# EAGLE schematic board (EAGLE 7.5.0)
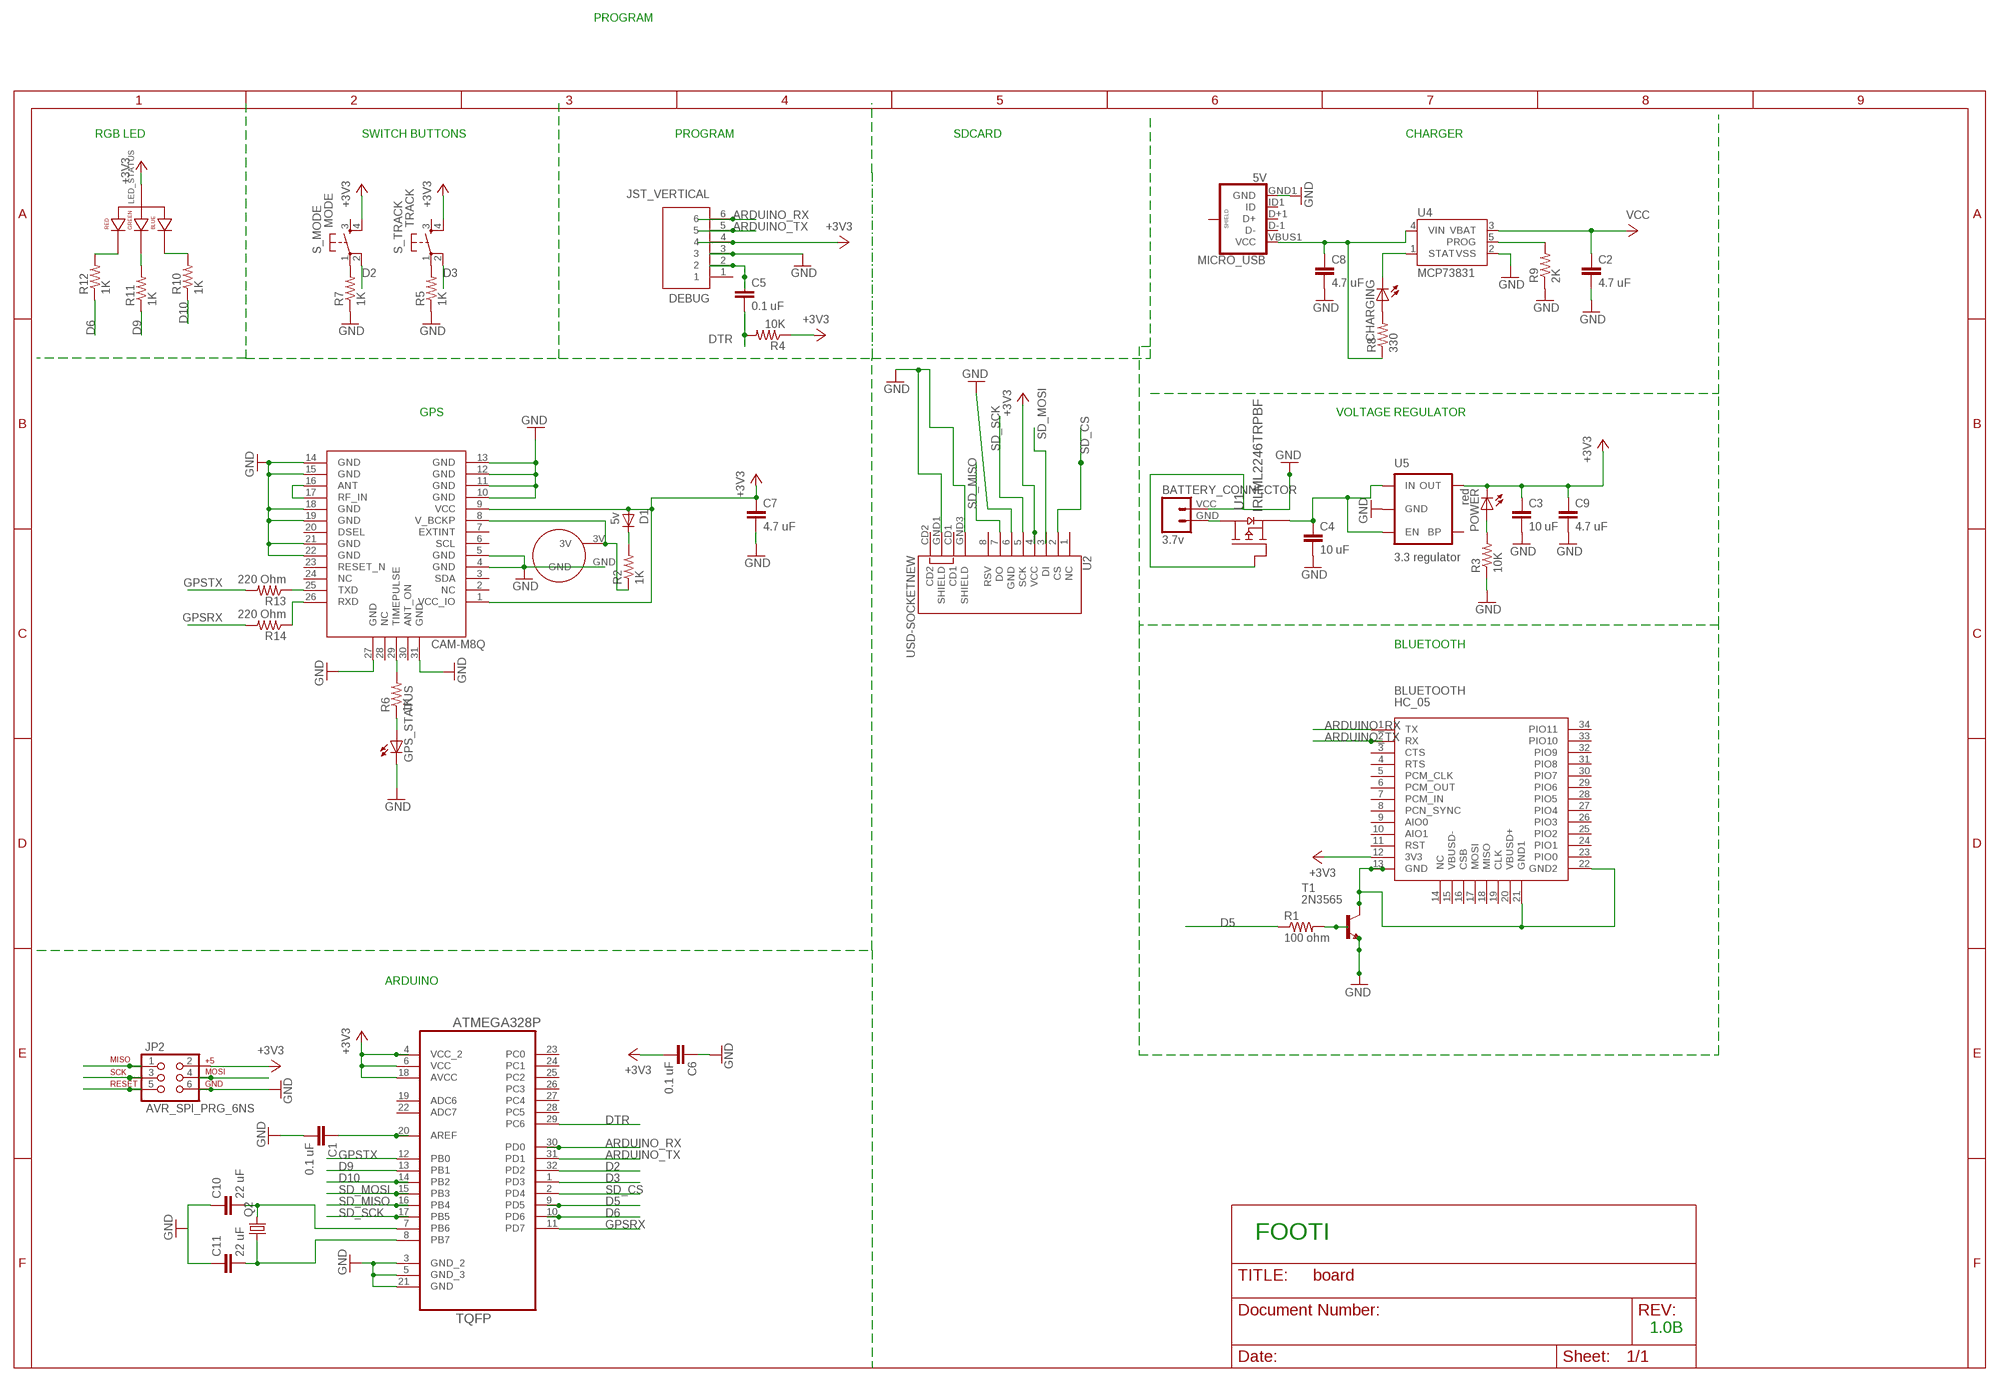
[diagram p0: schematic, sheet 1]

## Parts
BATTERY_CONNECTOR  3.7v  M024UCON-15767  [JST-2-SMD-VERT]
BLUETOOTH  HC_05  [BLUETOOTH_SMD]
C1  0.1 uF  CAP1206  [1206]
C2  4.7 uF  CAP1206  [1206]
C3  10 uF  CAP1206  [1206]
C4  10 uF  CAP1206  [1206]
C5  0.1 uF  CAP1206  [1206]
C6  0.1 uF  CAP1206  [1206]
C7  4.7 uF  CAP1206  [1206]
C8  4.7 uF  CAP1206  [1206]
C9  4.7 uF  CAP1206  [1206]
C10  22 uF  CAP1206  [1206]
C11  22 uF  CAP1206  [1206]
CHARGING  LED_E  [LED_1206]
D1  5v  GF1  [SMA-DO214AC]
DEBUG  JST_VERTICAL  [JST-6-SMD-VERT-1.0MM]
GPS_STATUS  LED_E  [LED_1206]
JP2  AVR_SPI_PRG_6NS  [2X3-NS]
LED_STATUS  LED_RGB_PLCC_AVAGO_MTB0  [LED_RGB_PLCC_AVAGO_MTB0]
MICRO_USB  5V  USB_MICROB_PLUGCONN-11752  [USB-B-MICRO-SMD_V03]
POWER  red  LED_E  [LED_1206]
Q2  CRYSTALCTS406  [CTS406]
R1  100 ohm  RESISTOR1206  [1206]
R2  1K  RESISTOR1206  [1206]
R3  10K  RESISTOR1206  [1206]
R4  10K  RESISTOR1206  [1206]
R5  1K  RESISTOR1206  [1206]
R6  1K  RESISTOR1206  [1206]
R7  1K  RESISTOR1206  [1206]
R8  330  RESISTOR1206  [1206]
R9  2K  RESISTOR1206  [1206]
R10  1K  RESISTOR1206  [1206]
R11  1K  RESISTOR1206  [1206]
R12  1K  RESISTOR1206  [1206]
R13  220 Ohm  RESISTOR1206  [1206]
R14  220 Ohm  RESISTOR1206  [1206]
S_MODE  MODE  DTSM-6  [DTSM-6]
S_TRACK  TRACK  DTSM-6  [DTSM-6]
T1  2N3565  [TO92]
U1  IRLML2246TRPBF  [SOT95P237X112-3N_O]
U2  USD-SOCKETNEW  [MICRO-SD-SOCKET-PP]
U3  CAM-M8Q  [CAM-M8Q]
U4  MCP73831  [SOT23-5]
U5  3.3 regulator  MIC52053.3V  [SOT23-5]
U6  ATMEGA328P-AU  [QFP80P900X900X120-32N]
U$3  MS621FE-FL11E  [MS621FE-FL11E]

## Nets
+3V3: BLUETOOTH.12(3V3) C3.1 C6.2 C7.1 C9.1 D1.A DEBUG.4 JP2.2 LED_STATUS.1(ANODE) POWER.C R4.1 S_MODE.4 S_TRACK.4 U2.4(VCC) U3.1(VCC_IO) U3.9(VCC) U5.5(OUT) U6.4(VCC_2) U6.6(VCC) U6.18(AVCC)
ARDUINO_RX: BLUETOOTH.1(TX) DEBUG.6 U6.30(PD0)
ARDUINO_TX: BLUETOOTH.2(RX) DEBUG.5 U6.31(PD1)
D2: S_MODE.2 U6.32(PD2)
D3: S_TRACK.2 U6.1(PD3)
D5: R1.1 U6.9(PD5)
D6: R12.1 U6.10(PD6)
D9: R11.1 U6.13(PB1)
D10: R10.1 U6.14(PB2)
DTR: C5.2 JP2.5 R4.2 U6.29(PC6)
GND [ground]: BATTERY_CONNECTOR.VCC C1.2 C2.2 C3.2 C4.2 C6.1 C7.2 C8.2 C9.2 C10.1 C11.1 DEBUG.3 GPS_STATUS.C JP2.6 MICRO_USB.GND1(GND) R3.1 R5.1 R7.1 R9.1 T1.3(E) U1.1(G) U2.6(GND) U2.GND1(SHIELD) U2.GND3(SHIELD) U3.4(GND) U3.5(GND) U3.10(GND) U3.11(GND) U3.12(GND) U3.13(GND) U3.14(GND) U3.15(GND) U3.18(GND) U3.19(GND) U3.21(GND) U3.22(GND) U3.27(GND) U3.31(GND) U4.2(VSS) U5.2(GND) U6.3(GND_2) U6.5(GND_3) U6.21(GND) U$3.GND
GPSRX: R14.2 U6.11(PD7)
GPSTX: R13.2 U6.12(PB0)
N$1: D1.K(C) R2.2
N$2: C8.1 MICRO_USB.VBUS1(VCC) R8.1 U4.4(VIN)
N$3: U3.16(ANT) U3.17(RF_IN)
N$4: R6.2 U3.29(TIMEPULSE)
N$5: R2.1 U3.8(V_BCKP) U$3.3V
N$6: GPS_STATUS.A R6.1
N$8: CHARGING.A R8.2
N$9: R7.2 S_MODE.1
N$10: R5.2 S_TRACK.1
N$11: CHARGING.C U4.1(STAT)
N$13: C5.1 DEBUG.2
N$14: BATTERY_CONNECTOR.GND U1.3(D)
N$15: R9.2 U4.5(PROG)
N$16: POWER.A R3.2
N$17: LED_STATUS.3(GREEN_CATHODE) R11.2
N$18: LED_STATUS.4(RED_CATHODE) R12.2
N$19: R1.2 T1.2(B)
N$20: BLUETOOTH.13(GND) BLUETOOTH.21(GND1) BLUETOOTH.22(GND2) T1.1(C)
N$21: LED_STATUS.2(BLUE_CATHODE) R10.2
N$22: C1.1 U6.20(AREF)
N$25: R13.1 U3.25(TXD)
N$26: R14.1 U3.26(RXD)
N$27: C11.2 Q2.1 U6.8(PB7)
N$29: C10.2 Q2.3 U6.7(PB6)
SD_CS: U2.2(CS) U6.2(PD4)
SD_MISO: JP2.1 U2.7(DO) U6.16(PB4)
SD_MOSI: JP2.4 U2.3(DI) U6.15(PB3)
SD_SCK: JP2.3 U2.5(SCK) U6.17(PB5)
VCC: C2.1 C4.1 U1.2(S) U4.3(VBAT) U5.1(IN) U5.3(EN)
Unconnected: BLUETOOTH.3(CTS) BLUETOOTH.4(RTS) BLUETOOTH.5(PCM_CLK) BLUETOOTH.6(PCM_OUT) BLUETOOTH.7(PCM_IN) BLUETOOTH.8(PCN_SYNC) BLUETOOTH.9(AIO0) BLUETOOTH.10(AIO1) BLUETOOTH.11(RST) BLUETOOTH.14(NC) BLUETOOTH.15(VBUSD-) BLUETOOTH.16(CSB) BLUETOOTH.17(MOSI) BLUETOOTH.18(MISO) BLUETOOTH.19(CLK) BLUETOOTH.20(VBUSD+) BLUETOOTH.23(PIO0) BLUETOOTH.24(PIO1) BLUETOOTH.25(PIO2) BLUETOOTH.26(PIO3) BLUETOOTH.27(PIO4) BLUETOOTH.28(PIO5) BLUETOOTH.29(PIO6) BLUETOOTH.30(PIO7) BLUETOOTH.31(PIO8) BLUETOOTH.32(PIO9) BLUETOOTH.33(PIO10) BLUETOOTH.34(PIO11) DEBUG.1 MICRO_USB.D+1(D+) MICRO_USB.D-1(D-) MICRO_USB.ID1(ID) MICRO_USB.SHIELD1(SHIELD) MICRO_USB.SHIELD2(SHIELD) MICRO_USB.SHIELD3(SHIELD) S_MODE.3 S_TRACK.3 U2.1(NC) U2.8(RSV) U2.CD1 U2.CD2 U3.2(NC) U3.3(SDA) U3.6(SCL) U3.7(EXTINT) U3.20(DSEL) U3.23(RESET_N) U3.24(NC) U3.28(NC) U3.30(ANT_ON) U5.4(BP) U6.19(ADC6) U6.22(ADC7) U6.23(PC0) U6.24(PC1) U6.25(PC2) U6.26(PC3) U6.27(PC4) U6.28(PC5)

## Notes on the sheet
- PROGRAM
- RGB LED | SWITCH BUTTONS | PROGRAM | SDCARD | CHARGER
- GPS | VOLTAGE REGULATOR
- BLUETOOTH
- ARDUINO
- FOOTI
- 1.0B

## Library data of the parts
BATTERY_CONNECTOR = SparkFun-Connectors:M02: Standard 2-pin 0.1" header. Use with - straight break away headers ( PRT-00116) - right angle break away headers (PRT-00553) - swiss pins (PRT-00743) - machine pins (PRT-00117) - female headers (PRT-00115) Molex polarized connector foot print use with: PRT-08233 with associated crimp pins and housings. 2.54_SCREWTERM for use with PRT-10571. 3.5mm Screw Terminal footprints for PRT-08084 5mm Screw Terminal footprints for use with PRT-08432; OC_FARNELL: unknown
BLUETOOTH = SerialPortBluetooth:HC_05; OC_FARNELL: unknown
C1 C5 C6 = SparkFun-Capacitors:CAP: Capacitor Standard 0603 ceramic capacitor, and 0.1" leaded capacitor.; MF: KEMET; MPN: C0402C104K4RACTU; OC_FARNELL: 1288252
C2 C7-C9 = SparkFun-Capacitors:CAP: Capacitor Standard 0603 ceramic capacitor, and 0.1" leaded capacitor.; MF: WALSIN; MPN: 1206B475K500CT; OC_FARNELL: 2497114
C3 C4 = SparkFun-Capacitors:CAP: Capacitor Standard 0603 ceramic capacitor, and 0.1" leaded capacitor.; MF: WALSIN; MPN: 1206B106K160CT; OC_FARNELL: 2497081
C10 C11 = SparkFun-Capacitors:CAP: Capacitor Standard 0603 ceramic capacitor, and 0.1" leaded capacitor.; MF: MULTICOMP; MPN: MC1206F226Z100CT; OC_FARNELL: 1759435
CHARGING GPS_STATUS = eagle-ltspice:LED_E: LED Source: http://www.osram.convergy.de Source: www.luxeon.com Source: www.kingbright.com; MF: KINGBRIGHT; MPN: KPTL-3216ZGC; OC_FARNELL: 2217899; SPICEMODEL: NONE; SPICEPREFIX: D; SPICETYPE: diode
D1 = diode:GF1: DIODE; FARNELL: 1827607; MF: VISHAY; MPN: BZG03C18TR3; OC_FARNELL: 9398112
DEBUG = SparkFun-Connectors:JST_VERTICAL; OC_FARNELL: unknown; PROD_ID: CONN-08249
JP2 = SparkFun-Connectors:AVR_SPI_PRG_6: AVR ISP 6 Pin This is the reduced ISP connector for AVR programming. Common on Arduino. This footprint will take up less PCB space and can be used with a 10-pin to 6-pin adapter such as SKU: BOB-08508 **Special note about "TEST_POINT" package. The stop mask is on the top side, so if you want your programming test points to be on the bottom of your board, make sure to place this package on the bottom side of the board. This also ensure that the orientation to program from the bottom side will be correct.; OC_FARNELL: unknown
LED_STATUS = pretender:LED_RGB_PLCC_AVAGO_MTB0; MF: AVAGO TECHNOLOGIES; MPN: ASMB-MTB0-0A3A2; OC_FARNELL: 2401105
MICRO_USB = SparkFun-Connectors:USB_MICROB_PLUG: USB Micro-B connectors Some male, some female. Watch your step!; OC_FARNELL: unknown; PROD_ID: CONN-11752
POWER = eagle-ltspice:LED_E: LED Source: http://www.osram.convergy.de Source: www.luxeon.com Source: www.kingbright.com; MF: KINGBRIGHT; MPN: KPTL-3216SURCK-01; OC_FARNELL: 2217903; SPICEMODEL: NONE; SPICEPREFIX: D; SPICETYPE: diode
Q2 = crystal:CRYSTAL: CRYSTAL; MF: ABRACON; MPN: ABMM2-8.000MHZ-E2-T; OC_FARNELL: 1611803; OC_NEWARK: unknown
R1 = SparkFun-Passives:RESISTOR: Resistor Basic schematic elements and footprints for 0603, 1206, and PTH resistors.; MF: YAGEO (PHYCOMP); MPN: RC1206FR-07100RL; OC_FARNELL: 9240888
R2 R5-R7 R10-R14 = SparkFun-Passives:RESISTOR: Resistor Basic schematic elements and footprints for 0603, 1206, and PTH resistors.; MF: VISHAY; MPN: CRCW12061K00FKTA; OC_FARNELL: 1653075
R3 R4 = SparkFun-Passives:RESISTOR: Resistor Basic schematic elements and footprints for 0603, 1206, and PTH resistors.; MF: VISHAY; MPN: CRCW120610K0FKEA; OC_FARNELL: 1469970
R8 = SparkFun-Passives:RESISTOR: Resistor Basic schematic elements and footprints for 0603, 1206, and PTH resistors.; MF: WELWYN; MPN: WCR1206-330RFI; OC_FARNELL: 1100177
R9 = SparkFun-Passives:RESISTOR: Resistor Basic schematic elements and footprints for 0603, 1206, and PTH resistors.; MF: VISHAY; MPN: CRCW12062K00FKEA; OC_FARNELL: 1469985
S_MODE S_TRACK = switch-tact:DTSM-6; MF: TE CONNECTIVITY; MPN: FSM1LP; OC_FARNELL: 1813691
T1 = transistor:2N3565: NPN TRANSISTOR; MF: ON SEMICONDUCTOR; MPN: 2N5089G; OC_FARNELL: 1126530
U1 = pretender:IRLML2246TRPBF: HEXFET Power MOSFET; MF: INFINEON; MPN: IRLML2246TRPBF; OC_FARNELL: 1888166; OC_NEWARK: 40T7450; PACKAGE: SOT-3; SUPPLIER: International Rectifier
U2 = SparkFun-Connectors:USD-SOCKET: microSD Socket Push-push type uSD socket. Schematic element and footprint production proven. Spark Fun Electronics SKU : PRT-00127. tDoc lines correctly indicate media card edge positions when inserting (unlocked, locked, depressed). NOTE: CD1 and CD2 are connected internally; MF: MULTICOMP; MPN: 460DE08C3; OC_FARNELL: 1686452; PROD_ID: CONN-07820
U3 = CAM-M8Q:CAM-M8Q; OC_FARNELL: unknown
U4 = SparkFun-PowerIC:MCP73831: Miniature single cell, fully integrated Li-Ion, Li-polymer charge management controller http://ww1.microchip.com/downloads/en/DeviceDoc/20001984g.pdf IC-09995; MF: MICROCHIP; MPN: MCP73831T-2ACI/OT; OC_FARNELL: 1332158; PROD_ID: IC-09995
U5 = SparkFun-PowerIC:MIC5205: MIC5205 150mA vreg 3.3V - VREG-00822 5V - VREG-00823; MF: MICREL SEMICONDUCTOR; MPN: MIC5205-3.3YM5 TR; OC_FARNELL: 1663083; PROD_ID: VREG-00822
U6 = Ava:ATMEGA328P-AU; DESCRIPTION: 8-bit Microcontroller with In-System Programmable Flash; MF: ATMEL; MPN: ATMEGA328P-AU; OC_FARNELL: 1715486; OC_NEWARK: 14R4631; PACKAGE: TQFP-32; SUPPLIER: Atmel
U$3 = footie:MS621FE-FL11E; FARNELL: 1614634; MF: SEIKO INSTRUMENTS; MPN: MS621FE-FL11E; OC_FARNELL: 1614634

## Net classes
1 ground: width 0.508 mm